# Altium schematic sheet toplevel.SchDoc: The Things Gateway Toplevel Overview
size A2; DocumentNumber: 1; SheetNumber: 1; SheetTotal: 9
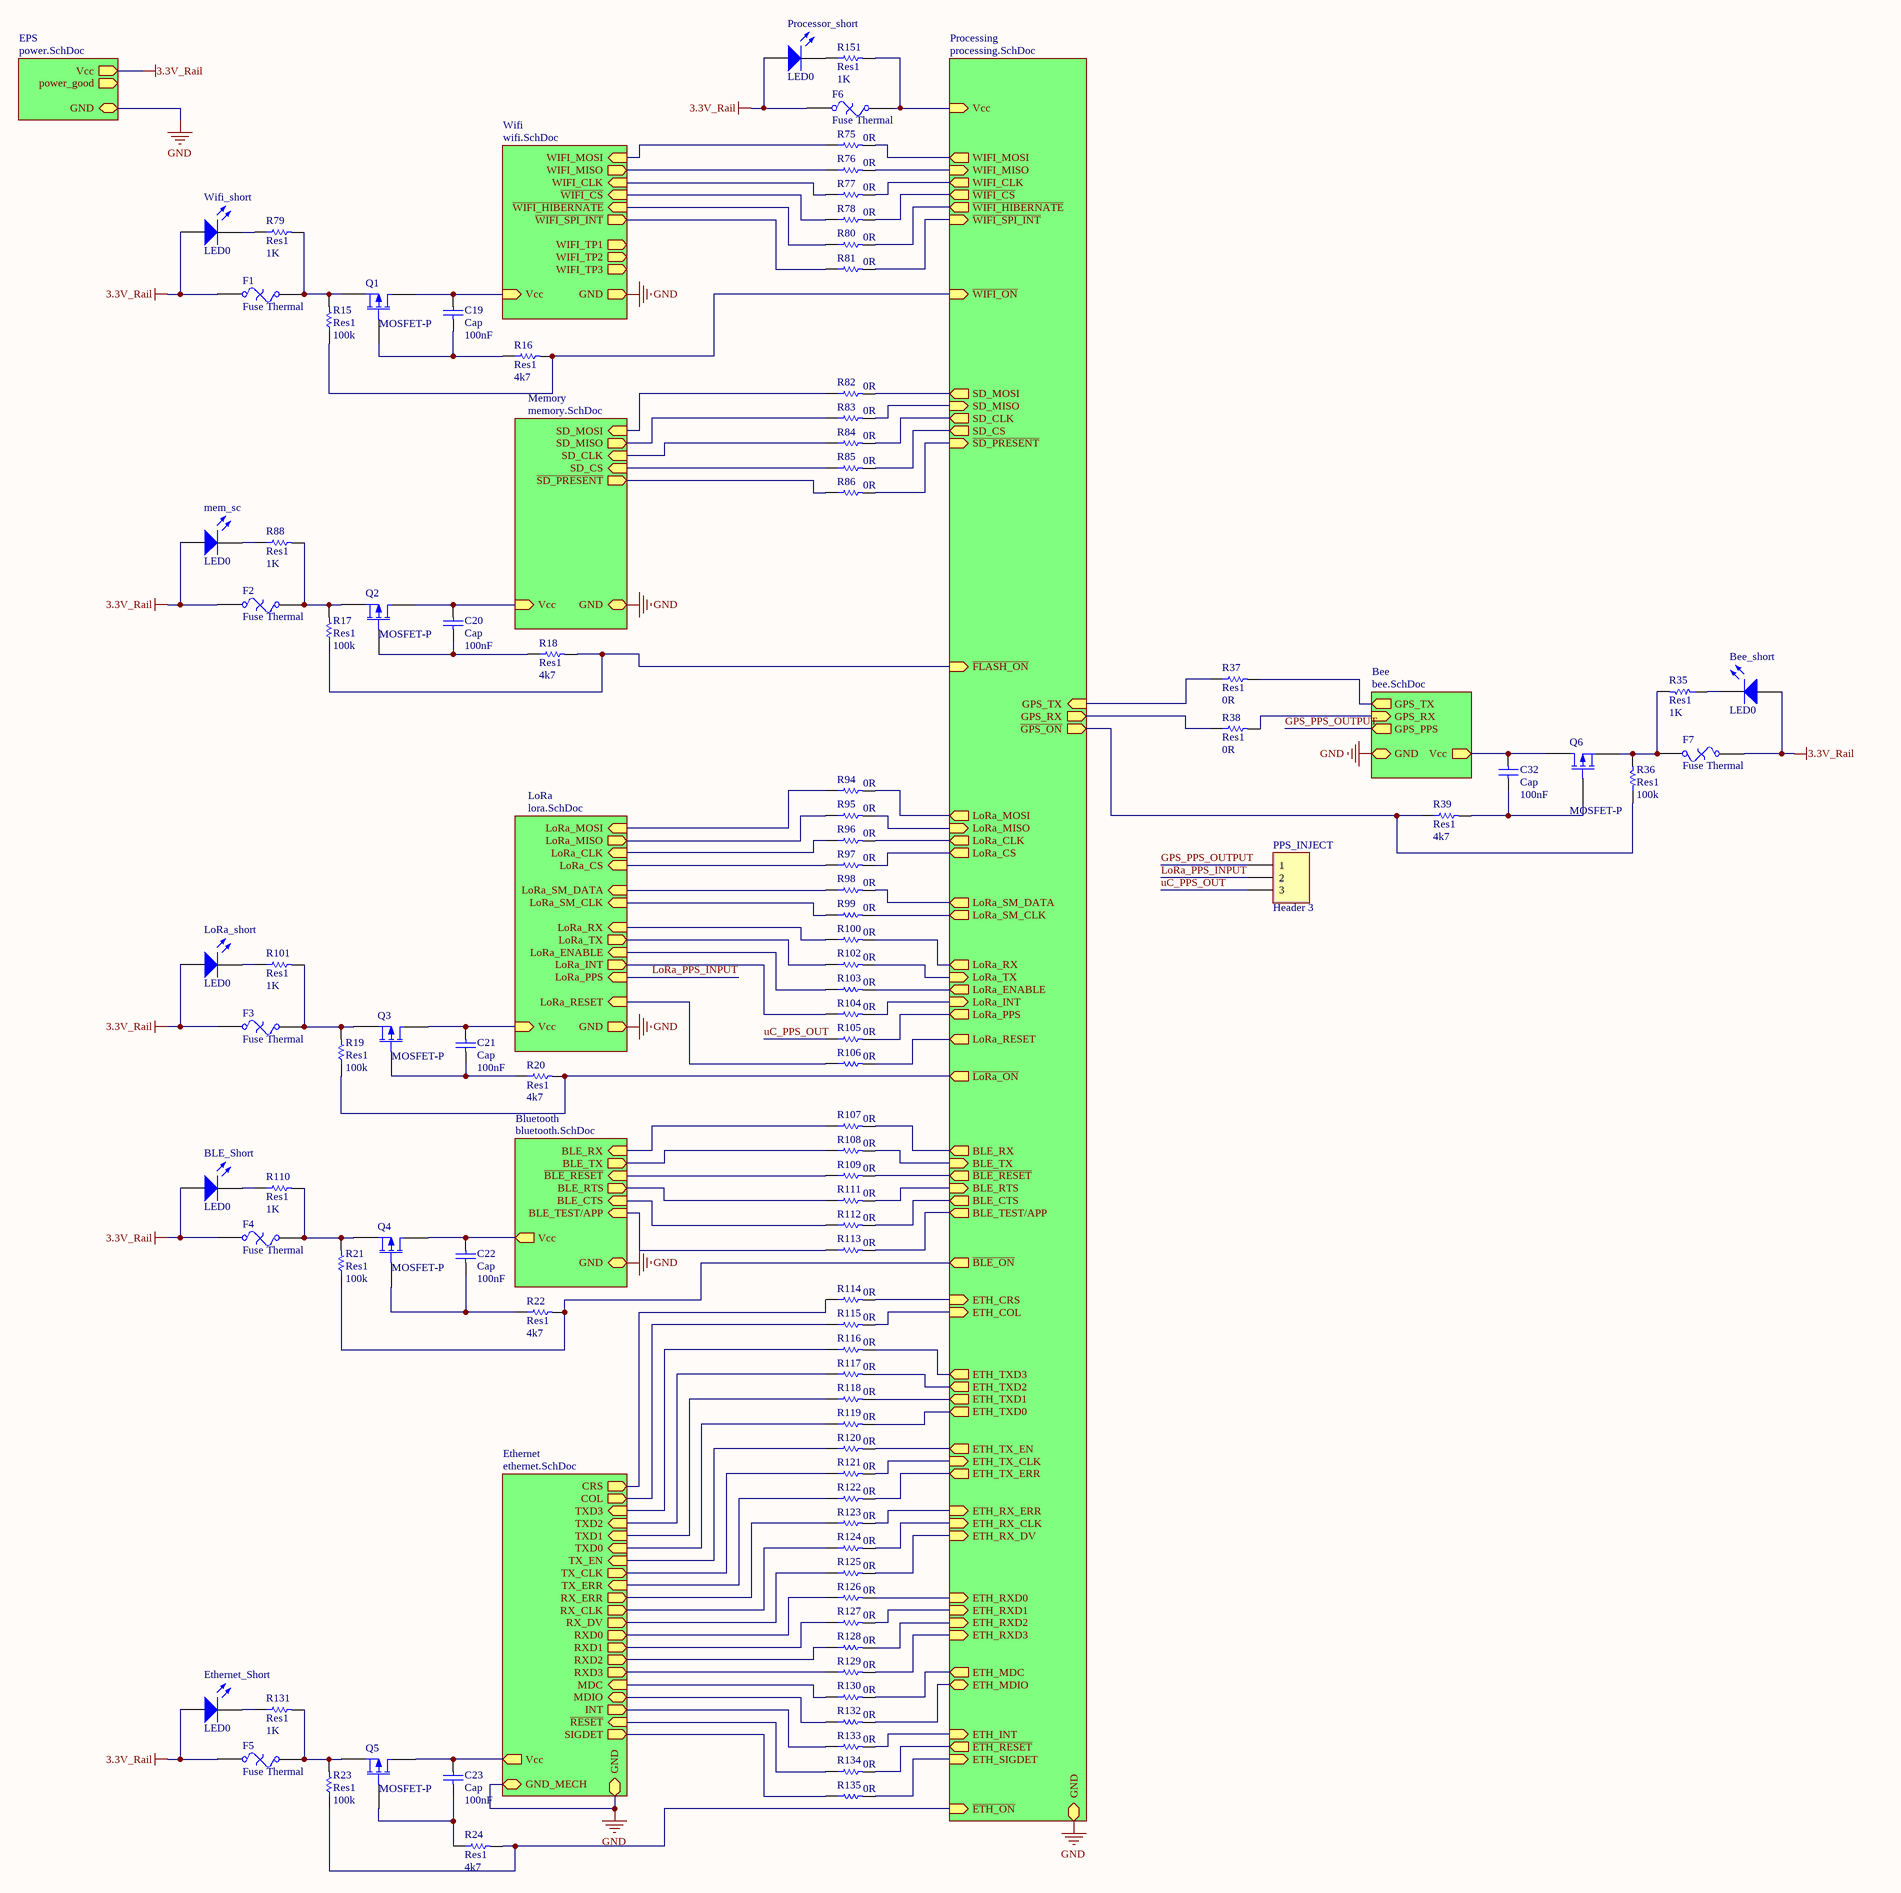
[diagram p0: toplevel.SchDoc]

## Parts
Bee_short  LED0  [C0603]
BLE_Short  LED0  [C0603]
C19  Cap  value 100nF  [6-0805_L]
C20  Cap  value 100nF  [6-0805_L]
C21  Cap  value 100nF  [6-0805_L]
C22  Cap  value 100nF  [6-0805_L]
C23  Cap  value 100nF  [6-0805_L]
C32  Cap  value 100nF  [6-0805_L]
Ethernet_Short  LED0  [C0603]
F1  Fuse Thermal  [1812-polyfuse]
F2  Fuse Thermal  [1812-polyfuse]
F3  Fuse Thermal  [1812-polyfuse]
F4  Fuse Thermal  [1812-polyfuse]
F5  Fuse Thermal  [1812-polyfuse]
F6  Fuse Thermal  [1812-polyfuse]
F7  Fuse Thermal  [1812-polyfuse]
LoRa_short  LED0  [C0603]
mem_sc  LED0  [C0603]
PPS_INJECT  Header 3  [HDR1X3]
Processor_short  LED0  [C0603]
Q1  MOSFET-P  [SOT23_N]
Q2  MOSFET-P  [SOT23_N]
Q3  MOSFET-P  [SOT23_N]
Q4  MOSFET-P  [SOT23_N]
Q5  MOSFET-P  [SOT23_N]
Q6  MOSFET-P  [SOT23_N]
R15  Res1  value 100k  [R0603]
R16  Res1  value 4k7  [R0603]
R17  Res1  value 100k  [R0603]
R18  Res1  value 4k7  [R0603]
R19  Res1  value 100k  [R0603]
R20  Res1  value 4k7  [R0603]
R21  Res1  value 100k  [R0603]
R22  Res1  value 4k7  [R0603]
R23  Res1  value 100k  [R0603]
R24  Res1  value 4k7  [R0603]
R35  Res1  value 1K  [R0603]
R36  Res1  value 100k  [R0603]
R37  Res1  value 0R  [R0603]
R38  Res1  value 0R  [R0603]
R39  Res1  value 4k7  [R0603]
R75  value 0R  [R0603]
R76  value 0R  [R0603]
R77  value 0R  [R0603]
R78  value 0R  [R0603]
R79  Res1  value 1K  [R0603]
R80  value 0R  [R0603]
R81  value 0R  [R0603]
R82  value 0R  [R0603]
R83  value 0R  [R0603]
R84  value 0R  [R0603]
R85  value 0R  [R0603]
R86  value 0R  [R0603]
R88  Res1  value 1K  [R0603]
R94  value 0R  [R0603]
R95  value 0R  [R0603]
R96  value 0R  [R0603]
R97  value 0R  [R0603]
R98  value 0R  [R0603]
R99  value 0R  [R0603]
R100  value 0R  [R0603]
R101  Res1  value 1K  [R0603]
R102  value 0R  [R0603]
R103  value 0R  [R0603]
R104  value 0R  [R0603]
R105  value 0R  [R0603]
R106  value 0R  [R0603]
R107  value 0R  [R0603]
R108  value 0R  [R0603]
R109  value 0R  [R0603]
R110  Res1  value 1K  [R0603]
R111  value 0R  [R0603]
R112  value 0R  [R0603]
R113  value 0R  [R0603]
R114  value 0R  [R0603]
R115  value 0R  [R0603]
R116  value 0R  [R0603]
R117  value 0R  [R0603]
R118  value 0R  [R0603]
R119  value 0R  [R0603]
R120  value 0R  [R0603]
R121  value 0R  [R0603]
R122  value 0R  [R0603]
R123  value 0R  [R0603]
R124  value 0R  [R0603]
R125  value 0R  [R0603]
R126  value 0R  [R0603]
R127  value 0R  [R0603]
R128  value 0R  [R0603]
R129  value 0R  [R0603]
R130  value 0R  [R0603]
R131  Res1  value 1K  [R0603]
R132  value 0R  [R0603]
R133  value 0R  [R0603]
R134  value 0R  [R0603]
R135  value 0R  [R0603]
R151  Res1  value 1K  [R0603]
Wifi_short  LED0  [C0603]

## Sub-sheets
Bee = bee.SchDoc: Vcc (out), GND, GPS_TX (out), GPS_RX (in), GPS_PPS (out)
Bluetooth = bluetooth.SchDoc: Vcc (out), GND (bidir), BLE_RX (in), BLE_TX (out), ~{BLE_RESET} (in), BLE_RTS (out), BLE_CTS (in), BLE_TEST/APP (in)
EPS = power.SchDoc: Vcc (out), GND (bidir), power_good (out)
Ethernet = ethernet.SchDoc: CRS (out), COL (out), TXD3 (in), TXD2 (in), TXD1 (in), TXD0 (in), TX_EN (in), TX_CLK (out), TX_ERR (in), RX_ERR (out), RX_CLK (out), RX_DV (out), RXD0 (out), RXD1 (out), RXD2 (out), RXD3 (out), MDC (in), MDIO, INT (out), ~{RESET} (in), SIGDET (out), Vcc (out), GND (bidir), GND_MECH (bidir)
LoRa = lora.SchDoc: LoRa_MOSI (in), LoRa_MISO (out), LoRa_CLK (in), LoRa_CS (in), LoRa_RX (in), LoRa_TX (out), LoRa_INT (out), LoRa_PPS (in), LoRa_ENABLE (in), LoRa_RESET (in), Vcc (in), GND (out), LoRa_SM_DATA (in), LoRa_SM_CLK (in)
Memory = memory.SchDoc: SD_MOSI (in), SD_MISO (out), SD_CLK (in), SD_CS (in), Vcc (in), GND, ~{SD_PRESENT} (out)
Processing = processing.SchDoc: WIFI_MOSI (out), WIFI_MISO (in), WIFI_CLK (out), ~{WIFI_CS} (out), ~{WIFI_SPI_INT} (in), ~{WIFI_HIBERNATE} (out), SD_MOSI (out), SD_MISO (in), SD_CLK (out), SD_CS (out), ~{SD_PRESENT} (in), LoRa_MOSI (out), LoRa_MISO (in), LoRa_CLK (out), LoRa_CS (out), LoRa_SM_DATA (out), LoRa_SM_CLK (out), LoRa_RX (out), LoRa_TX (in), LoRa_INT (in), LoRa_PPS (out), LoRa_ENABLE (out), LoRa_RESET (out), BLE_RX (out), BLE_TX (in), ~{BLE_RESET} (out), BLE_RTS (in), BLE_CTS (out), BLE_TEST/APP (out), ETH_CRS (in), ETH_COL (in), ETH_TXD3 (out), ETH_TXD2 (out), ETH_TXD1 (out), ETH_TXD0 (out), ETH_TX_EN (out), ETH_TX_CLK (in), ETH_TX_ERR (out), ETH_RX_ERR (in), ETH_RX_CLK (in), ETH_RX_DV (in), ETH_RXD0 (in), ETH_RXD1 (in), ETH_RXD2 (in), ETH_RXD3 (in), ETH_MDC (out), ETH_MDIO, ETH_INT (in), ~{ETH_RESET} (out), ETH_SIGDET (in), Vcc (in), GND (bidir), ~{WIFI_ON} (in), ~{FLASH_ON} (in), ~{LoRa_ON} (out), ~{BLE_ON} (out), ~{ETH_ON} (in), GPS_TX (in), ~{GPS_ON} (out), GPS_RX (out)
Wifi = wifi.SchDoc: Vcc (in), GND (out), WIFI_MOSI (in), WIFI_MISO (out), WIFI_CLK (in), ~{WIFI_CS} (in), WIFI_TP1 (out), WIFI_TP2 (out), WIFI_TP3 (out), ~{WIFI_HIBERNATE} (in), ~{WIFI_SPI_INT} (out)

## Nets
3.3V_Rail: Bee_short.1(A) BLE_Short.1(A) Ethernet_Short.1(A) F1.1 F2.1 F3.1 F4.1 F5.1 F6.1 F7.1 LoRa_short.1(A) mem_sc.1(A) Processor_short.1(A) Wifi_short.1(A) ; sheet EPS/Vcc
GND: sheet EPS/GND, sheet Wifi/GND, sheet Memory/GND, sheet Ethernet/GND, sheet Ethernet/GND_MECH, sheet LoRa/GND, sheet Bluetooth/GND, sheet Processing/GND, sheet Bee/GND
GPS_PPS_OUTPUT: PPS_INJECT.1 ; sheet Bee/GPS_PPS
LoRa_PPS_INPUT: PPS_INJECT.2 ; sheet LoRa/LoRa_PPS
uC_PPS_OUT: PPS_INJECT.3 R105.1
NetBee_short_2: Bee_short.2(K) R35.1
NetBLE_Short_2: BLE_Short.2(K) R110.1
NetC19_1: C19.1 Q1.2(G) R16.1
NetC19_2: C19.2 Q1.1(D) ; sheet Wifi/Vcc
NetC20_1: C20.1 Q2.2(G) R18.1
NetC20_2: C20.2 Q2.1(D) ; sheet Memory/Vcc
NetC21_1: C21.1 Q3.2(G) R20.1
NetC21_2: C21.2 Q3.1(D) ; sheet LoRa/Vcc
NetC22_1: C22.1 Q4.2(G) R22.1
NetC22_2: C22.2 Q4.1(D) ; sheet Bluetooth/Vcc
NetC23_1: C23.1 Q5.2(G) R24.1
NetC23_2: C23.2 Q5.1(D) ; sheet Ethernet/Vcc
NetC32_1: C32.1 Q6.2(G) R39.2
NetC32_2: C32.2 Q6.1(D) ; sheet Bee/Vcc
NetEthernet_Short_2: Ethernet_Short.2(K) R131.1
NetF1_2: F1.2 Q1.3(S) R15.2 R79.2
NetF2_2: F2.2 Q2.3(S) R17.2 R88.2
NetF3_2: F3.2 Q3.3(S) R19.2 R101.2
NetF4_2: F4.2 Q4.3(S) R21.2 R110.2
NetF5_2: F5.2 Q5.3(S) R23.2 R131.2
NetF6_2: F6.2 R151.2 ; sheet Processing/Vcc
NetF7_2: F7.2 Q6.3(S) R35.2 R36.2
NetLoRa_short_2: LoRa_short.2(K) R101.1
Netmem_sc_2: mem_sc.2(K) R88.1
NetProcessor_short_2: Processor_short.2(K) R151.1
NetR15_1: R15.1 R16.2 ; sheet Processing/~{WIFI_ON}
NetR17_1: R17.1 R18.2 ; sheet Processing/~{FLASH_ON}
NetR19_1: R19.1 R20.2 ; sheet Processing/~{LoRa_ON}
NetR21_1: R21.1 R22.2 ; sheet Processing/~{BLE_ON}
NetR23_1: R23.1 R24.2 ; sheet Processing/~{ETH_ON}
NetR36_1: R36.1 R39.1 ; sheet Processing/~{GPS_ON}
NetR37_1: R37.1 ; sheet Processing/GPS_TX
NetR37_2: R37.2 ; sheet Bee/GPS_TX
NetR38_1: R38.1 ; sheet Processing/GPS_RX
NetR38_2: R38.2 ; sheet Bee/GPS_RX
NetR75_1: R75.1 ; sheet Wifi/WIFI_MOSI
NetR75_2: R75.2 ; sheet Processing/WIFI_MOSI
NetR76_1: R76.1 ; sheet Wifi/WIFI_MISO
NetR76_2: R76.2 ; sheet Processing/WIFI_MISO
NetR77_1: R77.1 ; sheet Wifi/WIFI_CLK
NetR77_2: R77.2 ; sheet Processing/WIFI_CLK
NetR78_1: R78.1 ; sheet Wifi/~{WIFI_CS}
NetR78_2: R78.2 ; sheet Processing/~{WIFI_CS}
NetR79_1: R79.1 Wifi_short.2(K)
NetR80_1: R80.1 ; sheet Wifi/~{WIFI_HIBERNATE}
NetR80_2: R80.2 ; sheet Processing/~{WIFI_HIBERNATE}
NetR81_1: R81.1 ; sheet Wifi/~{WIFI_SPI_INT}
NetR81_2: R81.2 ; sheet Processing/~{WIFI_SPI_INT}
NetR82_1: R82.1 ; sheet Memory/SD_MOSI
NetR82_2: R82.2 ; sheet Processing/SD_MOSI
NetR83_1: R83.1 ; sheet Memory/SD_MISO
NetR83_2: R83.2 ; sheet Processing/SD_MISO
NetR84_1: R84.1 ; sheet Memory/SD_CLK
NetR84_2: R84.2 ; sheet Processing/SD_CLK
NetR85_1: R85.1 ; sheet Memory/SD_CS
NetR85_2: R85.2 ; sheet Processing/SD_CS
NetR86_1: R86.1 ; sheet Memory/~{SD_PRESENT}
NetR86_2: R86.2 ; sheet Processing/~{SD_PRESENT}
NetR94_1: R94.1 ; sheet LoRa/LoRa_MOSI
NetR94_2: R94.2 ; sheet Processing/LoRa_MOSI
NetR95_1: R95.1 ; sheet LoRa/LoRa_MISO
NetR95_2: R95.2 ; sheet Processing/LoRa_MISO
NetR96_1: R96.1 ; sheet LoRa/LoRa_CLK
NetR96_2: R96.2 ; sheet Processing/LoRa_CLK
NetR97_1: R97.1 ; sheet LoRa/LoRa_CS
NetR97_2: R97.2 ; sheet Processing/LoRa_CS
NetR98_1: R98.1 ; sheet LoRa/LoRa_SM_DATA
NetR98_2: R98.2 ; sheet Processing/LoRa_SM_DATA
NetR99_1: R99.1 ; sheet LoRa/LoRa_SM_CLK
NetR99_2: R99.2 ; sheet Processing/LoRa_SM_CLK
NetR100_1: R100.1 ; sheet LoRa/LoRa_RX
NetR100_2: R100.2 ; sheet Processing/LoRa_RX
NetR102_1: R102.1 ; sheet LoRa/LoRa_TX
NetR102_2: R102.2 ; sheet Processing/LoRa_TX
NetR103_1: R103.1 ; sheet LoRa/LoRa_ENABLE
NetR103_2: R103.2 ; sheet Processing/LoRa_ENABLE
NetR104_1: R104.1 ; sheet LoRa/LoRa_INT
NetR104_2: R104.2 ; sheet Processing/LoRa_INT
NetR105_2: R105.2 ; sheet Processing/LoRa_PPS
NetR106_1: R106.1 ; sheet LoRa/LoRa_RESET
NetR106_2: R106.2 ; sheet Processing/LoRa_RESET
NetR107_1: R107.1 ; sheet Bluetooth/BLE_RX
NetR107_2: R107.2 ; sheet Processing/BLE_RX
NetR108_1: R108.1 ; sheet Bluetooth/BLE_TX
NetR108_2: R108.2 ; sheet Processing/BLE_TX
NetR109_1: R109.1 ; sheet Bluetooth/~{BLE_RESET}
NetR109_2: R109.2 ; sheet Processing/~{BLE_RESET}
NetR111_1: R111.1 ; sheet Bluetooth/BLE_RTS
NetR111_2: R111.2 ; sheet Processing/BLE_RTS
NetR112_1: R112.1 ; sheet Bluetooth/BLE_CTS
NetR112_2: R112.2 ; sheet Processing/BLE_CTS
NetR113_1: R113.1 ; sheet Bluetooth/BLE_TEST/APP
NetR113_2: R113.2 ; sheet Processing/BLE_TEST/APP
NetR114_1: R114.1 ; sheet Ethernet/CRS
NetR114_2: R114.2 ; sheet Processing/ETH_CRS
NetR115_1: R115.1 ; sheet Ethernet/COL
NetR115_2: R115.2 ; sheet Processing/ETH_COL
NetR116_1: R116.1 ; sheet Ethernet/TXD3
NetR116_2: R116.2 ; sheet Processing/ETH_TXD3
NetR117_1: R117.1 ; sheet Ethernet/TXD2
NetR117_2: R117.2 ; sheet Processing/ETH_TXD2
NetR118_1: R118.1 ; sheet Ethernet/TXD1
NetR118_2: R118.2 ; sheet Processing/ETH_TXD1
NetR119_1: R119.1 ; sheet Ethernet/TXD0
NetR119_2: R119.2 ; sheet Processing/ETH_TXD0
NetR120_1: R120.1 ; sheet Ethernet/TX_EN
NetR120_2: R120.2 ; sheet Processing/ETH_TX_EN
NetR121_1: R121.1 ; sheet Ethernet/TX_CLK
NetR121_2: R121.2 ; sheet Processing/ETH_TX_CLK
NetR122_1: R122.1 ; sheet Ethernet/TX_ERR
NetR122_2: R122.2 ; sheet Processing/ETH_TX_ERR
NetR123_1: R123.1 ; sheet Ethernet/RX_ERR
NetR123_2: R123.2 ; sheet Processing/ETH_RX_ERR
NetR124_1: R124.1 ; sheet Ethernet/RX_CLK
NetR124_2: R124.2 ; sheet Processing/ETH_RX_CLK
NetR125_1: R125.1 ; sheet Ethernet/RX_DV
NetR125_2: R125.2 ; sheet Processing/ETH_RX_DV
NetR126_1: R126.1 ; sheet Ethernet/RXD0
NetR126_2: R126.2 ; sheet Processing/ETH_RXD0
NetR127_1: R127.1 ; sheet Ethernet/RXD1
NetR127_2: R127.2 ; sheet Processing/ETH_RXD1
NetR128_1: R128.1 ; sheet Ethernet/RXD2
NetR128_2: R128.2 ; sheet Processing/ETH_RXD2
NetR129_1: R129.1 ; sheet Ethernet/RXD3
NetR129_2: R129.2 ; sheet Processing/ETH_RXD3
NetR130_1: R130.1 ; sheet Ethernet/MDC
NetR130_2: R130.2 ; sheet Processing/ETH_MDC
NetR132_1: R132.1 ; sheet Ethernet/MDIO
NetR132_2: R132.2 ; sheet Processing/ETH_MDIO
NetR133_1: R133.1 ; sheet Ethernet/INT
NetR133_2: R133.2 ; sheet Processing/ETH_INT
NetR134_1: R134.1 ; sheet Ethernet/~{RESET}
NetR134_2: R134.2 ; sheet Processing/~{ETH_RESET}
NetR135_1: R135.1 ; sheet Ethernet/SIGDET
NetR135_2: R135.2 ; sheet Processing/ETH_SIGDET

## Notes on the sheet
- Title
- The Things Products
- Size:
- Date:
- Project:
- A2
- Number:
- Time:
- Revision:
- Sheet
- of
- File:

## Library data of the parts
Bee_short BLE_Short Ethernet_Short LoRa_short mem_sc Processor_short Wifi_short = LED0: Typical INFRARED GaAs LED; Published: 8-Jun-2000; LatestRevisionDate: 08-Jul-2005; LatestRevisionNote: Mech Layer 1 removed.; PackageReference: LED-0; Publisher: Altium Limited; PackageDescription: LED; 2 Leads
C19-C23 C32 = Cap: Capacitor; Published: 8-Jun-2000; LatestRevisionDate: 17-Jul-2002; LatestRevisionNote: Re-released for DXP Platform.; PackageReference: RAD-0.3; Publisher: Altium Limited; PackageDescription: Radial Cap, Thru-Hole; 2 Leads; 0.3 in Pin Spacing
F1-F7 = Fuse Thermal: Thermal Fuse; Published: 24-Mar-1999; LatestRevisionDate: 17-Jul-2002; LatestRevisionNote: Re-released for DXP Platform.; PackageReference: PIN-W2/E2.8; Publisher: Altium Limited; PackageDescription: Thru-Hole; 2 Leads
PPS_INJECT = Header 3: Header, 3-Pin; LatestRevisionDate: 17-Jul-2002; LatestRevisionNote: Re-released for DXP Platform.; Publisher: Altium Limited
Q1-Q6 = MOSFET-P: P-Channel MOSFET; pin to pad: 2>3 3>2; Published: 8-Jun-2000; LatestRevisionDate: 17-Jul-2002; LatestRevisionNote: Re-released for DXP Platform.; PackageVersion: 1995/1996; PackageReference: E3; Publisher: Altium Limited; PackageDescription: TO, Flat Index; 3 In-Line, Axial Leads; Body Dia. 4.6mm; Lead Dia. 0.5 mm (max)
R15-R24 R35-R39 R75-R86 R88 R94-R135 R151 = Res1: Resistor; Published: 8-Jun-2000; LatestRevisionDate: 17-Jul-2002; LatestRevisionNote: Re-released for DXP Platform.; PackageReference: AXIAL-0.3; Publisher: Altium Limited; PackageDescription: Axial Device, Thru-Hole; 2 Leads; 0.3 in Pin Spacing